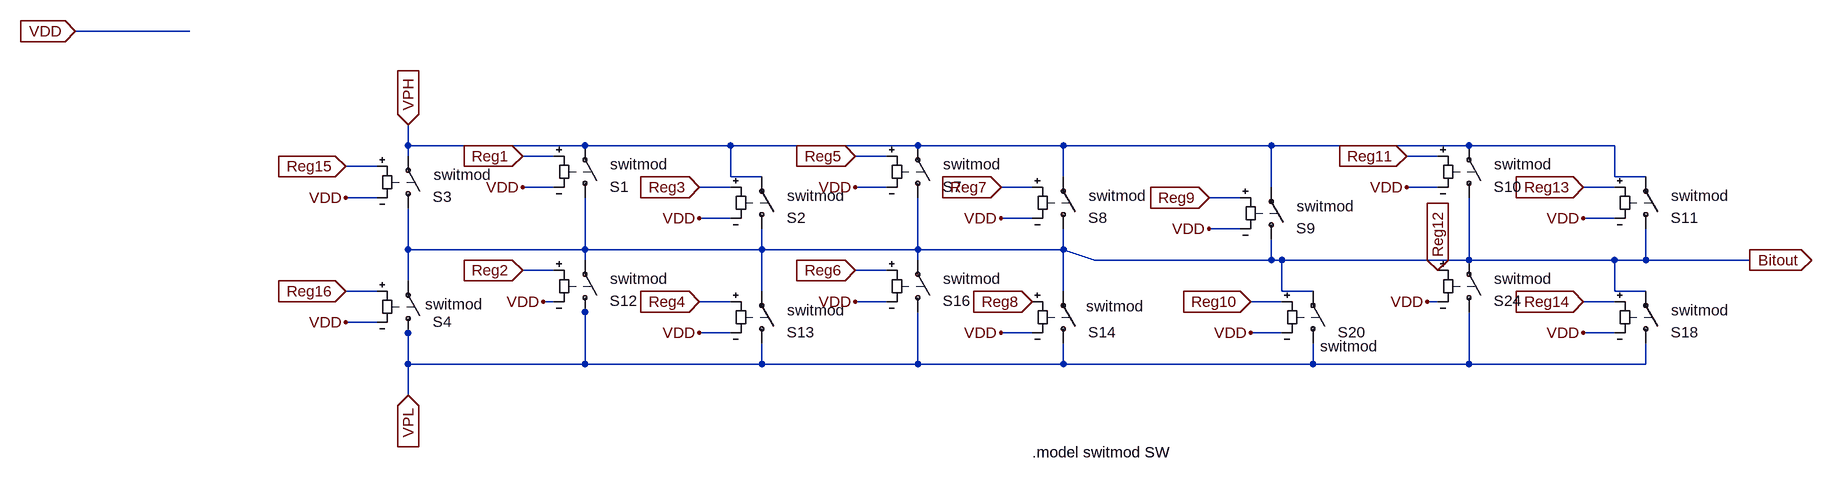
[diagram p0: schematic PG.asc]
PG.asc, the LTspice schematic file:
Version 4
SHEET 1 3216 696
WIRE 256 -1472 80 -1472
WIRE 592 -1296 592 -1328
WIRE 864 -1296 592 -1296
WIRE 1088 -1296 864 -1296
WIRE 1376 -1296 1088 -1296
WIRE 1600 -1296 1376 -1296
WIRE 1920 -1296 1600 -1296
WIRE 2224 -1296 1920 -1296
WIRE 2448 -1296 2224 -1296
WIRE 592 -1280 592 -1296
WIRE 816 -1280 768 -1280
WIRE 1328 -1280 1280 -1280
WIRE 2176 -1280 2128 -1280
WIRE 544 -1264 496 -1264
WIRE 1088 -1248 1088 -1296
WIRE 1136 -1248 1088 -1248
WIRE 1600 -1248 1600 -1296
WIRE 2448 -1248 2448 -1296
WIRE 2496 -1248 2448 -1248
WIRE 816 -1232 768 -1232
WIRE 1088 -1232 1040 -1232
WIRE 1328 -1232 1280 -1232
WIRE 1552 -1232 1504 -1232
WIRE 1920 -1232 1920 -1296
WIRE 2176 -1232 2128 -1232
WIRE 2448 -1232 2400 -1232
WIRE 544 -1216 496 -1216
WIRE 1872 -1216 1824 -1216
WIRE 1088 -1184 1040 -1184
WIRE 1552 -1184 1504 -1184
WIRE 2448 -1184 2400 -1184
WIRE 1872 -1168 1824 -1168
WIRE 592 -1136 592 -1200
WIRE 864 -1136 864 -1216
WIRE 864 -1136 592 -1136
WIRE 1136 -1136 1136 -1168
WIRE 1136 -1136 864 -1136
WIRE 1376 -1136 1376 -1216
WIRE 1376 -1136 1136 -1136
WIRE 1600 -1136 1600 -1168
WIRE 1600 -1136 1376 -1136
WIRE 864 -1120 864 -1136
WIRE 1376 -1120 1376 -1136
WIRE 1648 -1120 1600 -1136
WIRE 1920 -1120 1920 -1152
WIRE 1920 -1120 1648 -1120
WIRE 1936 -1120 1920 -1120
WIRE 2224 -1120 2224 -1216
WIRE 2224 -1120 1936 -1120
WIRE 2448 -1120 2224 -1120
WIRE 2496 -1120 2496 -1168
WIRE 2496 -1120 2448 -1120
WIRE 2656 -1120 2496 -1120
WIRE 816 -1104 768 -1104
WIRE 1328 -1104 1280 -1104
WIRE 592 -1088 592 -1136
WIRE 544 -1072 496 -1072
WIRE 1136 -1072 1136 -1136
WIRE 1600 -1072 1600 -1136
WIRE 1936 -1072 1936 -1120
WIRE 1984 -1072 1936 -1072
WIRE 2448 -1072 2448 -1120
WIRE 2496 -1072 2448 -1072
WIRE 816 -1056 800 -1056
WIRE 1088 -1056 1040 -1056
WIRE 1328 -1056 1280 -1056
WIRE 1568 -1056 1552 -1056
WIRE 1936 -1056 1888 -1056
WIRE 2176 -1056 2160 -1056
WIRE 2448 -1056 2400 -1056
WIRE 864 -1040 864 -1056
WIRE 544 -1024 496 -1024
WIRE 592 -1008 592 -1024
WIRE 1088 -1008 1040 -1008
WIRE 1552 -1008 1504 -1008
WIRE 1936 -1008 1888 -1008
WIRE 2448 -1008 2400 -1008
WIRE 592 -960 592 -1008
WIRE 864 -960 864 -1040
WIRE 864 -960 592 -960
WIRE 1136 -960 1136 -992
WIRE 1136 -960 864 -960
WIRE 1376 -960 1376 -1040
WIRE 1376 -960 1136 -960
WIRE 1600 -960 1600 -992
WIRE 1600 -960 1376 -960
WIRE 1984 -960 1984 -992
WIRE 1984 -960 1600 -960
WIRE 2224 -960 2224 -1040
WIRE 2224 -960 1984 -960
WIRE 2496 -960 2496 -992
WIRE 2496 -960 2224 -960
WIRE 592 -912 592 -960
FLAG 496 -1216 VDD
FLAG 2656 -1120 Bitout
IOPIN 2656 -1120 Out
FLAG 592 -912 VPL
IOPIN 592 -912 In
FLAG 592 -1328 VPH
IOPIN 592 -1328 In
FLAG 496 -1264 Reg15
IOPIN 496 -1264 In
FLAG 768 -1232 VDD
FLAG 768 -1280 Reg1
IOPIN 768 -1280 In
FLAG 1040 -1184 VDD
FLAG 1040 -1232 Reg3
IOPIN 1040 -1232 In
FLAG 1280 -1232 VDD
FLAG 1280 -1280 Reg5
IOPIN 1280 -1280 In
FLAG 1504 -1184 VDD
FLAG 1504 -1232 Reg7
IOPIN 1504 -1232 In
FLAG 1824 -1168 VDD
FLAG 1824 -1216 Reg9
IOPIN 1824 -1216 In
FLAG 2128 -1232 VDD
FLAG 2128 -1280 Reg11
IOPIN 2128 -1280 In
FLAG 2400 -1184 VDD
FLAG 2400 -1232 Reg13
IOPIN 2400 -1232 In
FLAG 80 -1472 VDD
IOPIN 80 -1472 In
FLAG 496 -1072 Reg16
IOPIN 496 -1072 In
FLAG 768 -1104 Reg2
IOPIN 768 -1104 In
FLAG 1040 -1056 Reg4
IOPIN 1040 -1056 In
FLAG 1280 -1104 Reg6
IOPIN 1280 -1104 In
FLAG 1552 -1056 Reg8
IOPIN 1552 -1056 In
FLAG 1888 -1056 Reg10
IOPIN 1888 -1056 In
FLAG 2176 -1104 Reg12
IOPIN 2176 -1104 In
FLAG 2400 -1056 Reg14
IOPIN 2400 -1056 In
FLAG 496 -1024 VDD
FLAG 1040 -1008 VDD
FLAG 800 -1056 VDD
FLAG 1280 -1056 VDD
FLAG 1504 -1008 VDD
FLAG 1888 -1008 VDD
FLAG 2160 -1056 VDD
FLAG 2400 -1008 VDD
SYMBOL sw 592 -1184 M180
WINDOW 3 24 -12 Left 0
WINDOW 38 39 67 Left 0
WINDOW 0 38 33 Left 0
SYMATTR Value ""
SYMATTR SpiceModel switmod
SYMATTR InstName S3
SYMBOL sw 592 -992 M180
WINDOW 3 24 -12 Left 0
WINDOW 38 26 60 Left 0
WINDOW 0 38 33 Left 0
SYMATTR Value ""
SYMATTR SpiceModel switmod
SYMATTR InstName S4
SYMBOL sw 864 -1200 M180
WINDOW 3 24 -12 Left 0
WINDOW 38 39 67 Left 0
WINDOW 0 38 33 Left 0
SYMATTR Value ""
SYMATTR SpiceModel switmod
SYMATTR InstName S1
SYMBOL sw 1136 -1152 M180
WINDOW 3 24 -12 Left 0
WINDOW 38 39 67 Left 0
WINDOW 0 38 33 Left 0
SYMATTR Value ""
SYMATTR SpiceModel switmod
SYMATTR InstName S2
SYMBOL sw 1376 -1200 M180
WINDOW 3 24 -12 Left 0
WINDOW 38 39 67 Left 0
WINDOW 0 38 33 Left 0
SYMATTR Value ""
SYMATTR SpiceModel switmod
SYMATTR InstName S7
SYMBOL sw 1600 -1152 M180
WINDOW 3 24 -12 Left 0
WINDOW 38 39 67 Left 0
WINDOW 0 38 33 Left 0
SYMATTR Value ""
SYMATTR SpiceModel switmod
SYMATTR InstName S8
SYMBOL sw 1920 -1136 M180
WINDOW 3 24 -12 Left 0
WINDOW 38 39 67 Left 0
WINDOW 0 38 33 Left 0
SYMATTR Value ""
SYMATTR SpiceModel switmod
SYMATTR InstName S9
SYMBOL sw 2224 -1200 M180
WINDOW 3 24 -12 Left 0
WINDOW 38 39 67 Left 0
WINDOW 0 38 33 Left 0
SYMATTR Value ""
SYMATTR SpiceModel switmod
SYMATTR InstName S10
SYMBOL sw 2496 -1152 M180
WINDOW 3 24 -12 Left 0
WINDOW 38 39 67 Left 0
WINDOW 0 38 33 Left 0
SYMATTR Value ""
SYMATTR SpiceModel switmod
SYMATTR InstName S11
SYMBOL sw 864 -1024 M180
WINDOW 3 24 -12 Left 0
WINDOW 38 39 67 Left 0
WINDOW 0 38 33 Left 0
SYMATTR Value ""
SYMATTR SpiceModel switmod
SYMATTR InstName S12
SYMBOL sw 1136 -976 M180
WINDOW 3 24 -12 Left 0
WINDOW 38 39 67 Left 0
WINDOW 0 38 33 Left 0
SYMATTR Value ""
SYMATTR SpiceModel switmod
SYMATTR InstName S13
SYMBOL sw 1376 -1024 M180
WINDOW 3 24 -12 Left 0
WINDOW 38 39 67 Left 0
WINDOW 0 38 33 Left 0
SYMATTR Value ""
SYMATTR SpiceModel switmod
SYMATTR InstName S16
SYMBOL sw 1984 -976 M180
WINDOW 3 24 -12 Left 0
WINDOW 38 11 11 Left 0
WINDOW 0 38 33 Left 0
SYMATTR Value ""
SYMATTR SpiceModel switmod
SYMATTR InstName S20
SYMBOL sw 2224 -1024 M180
WINDOW 3 24 -12 Left 0
WINDOW 38 39 67 Left 0
WINDOW 0 38 33 Left 0
SYMATTR Value ""
SYMATTR SpiceModel switmod
SYMATTR InstName S24
SYMBOL sw 2496 -976 M180
WINDOW 3 24 -12 Left 0
WINDOW 38 39 67 Left 0
WINDOW 0 38 33 Left 0
SYMATTR Value ""
SYMATTR SpiceModel switmod
SYMATTR InstName S18
SYMBOL sw 1600 -976 M180
WINDOW 3 24 -12 Left 0
WINDOW 38 35 73 Left 0
WINDOW 0 38 33 Left 0
SYMATTR Value ""
SYMATTR SpiceModel switmod
SYMATTR InstName S14
TEXT 1552 -824 Left 0 !.model switmod SW

The netlist it stands for:
* PG.asc
S3 Bitout VPH Reg15 VDD switmod
S4 VPL Bitout Reg16 VDD switmod
S1 Bitout VPH Reg1 VDD switmod
S2 Bitout VPH Reg3 VDD switmod
S7 Bitout VPH Reg5 VDD switmod
S8 Bitout VPH Reg7 VDD switmod
S9 Bitout VPH Reg9 VDD switmod
S10 Bitout VPH Reg11 VDD switmod
S11 Bitout VPH Reg13 VDD switmod
S12 VPL Bitout Reg2 VDD switmod
S13 VPL Bitout Reg4 VDD switmod
S16 VPL Bitout Reg6 VDD switmod
S20 VPL Bitout Reg10 VDD switmod
S24 VPL Bitout Reg12 VDD switmod
S18 VPL Bitout Reg14 VDD switmod
S14 VPL Bitout Reg8 VDD switmod
.model switmod SW
.backanno
.end